# Altium project lab2_kochurin_buck.PrjPcb
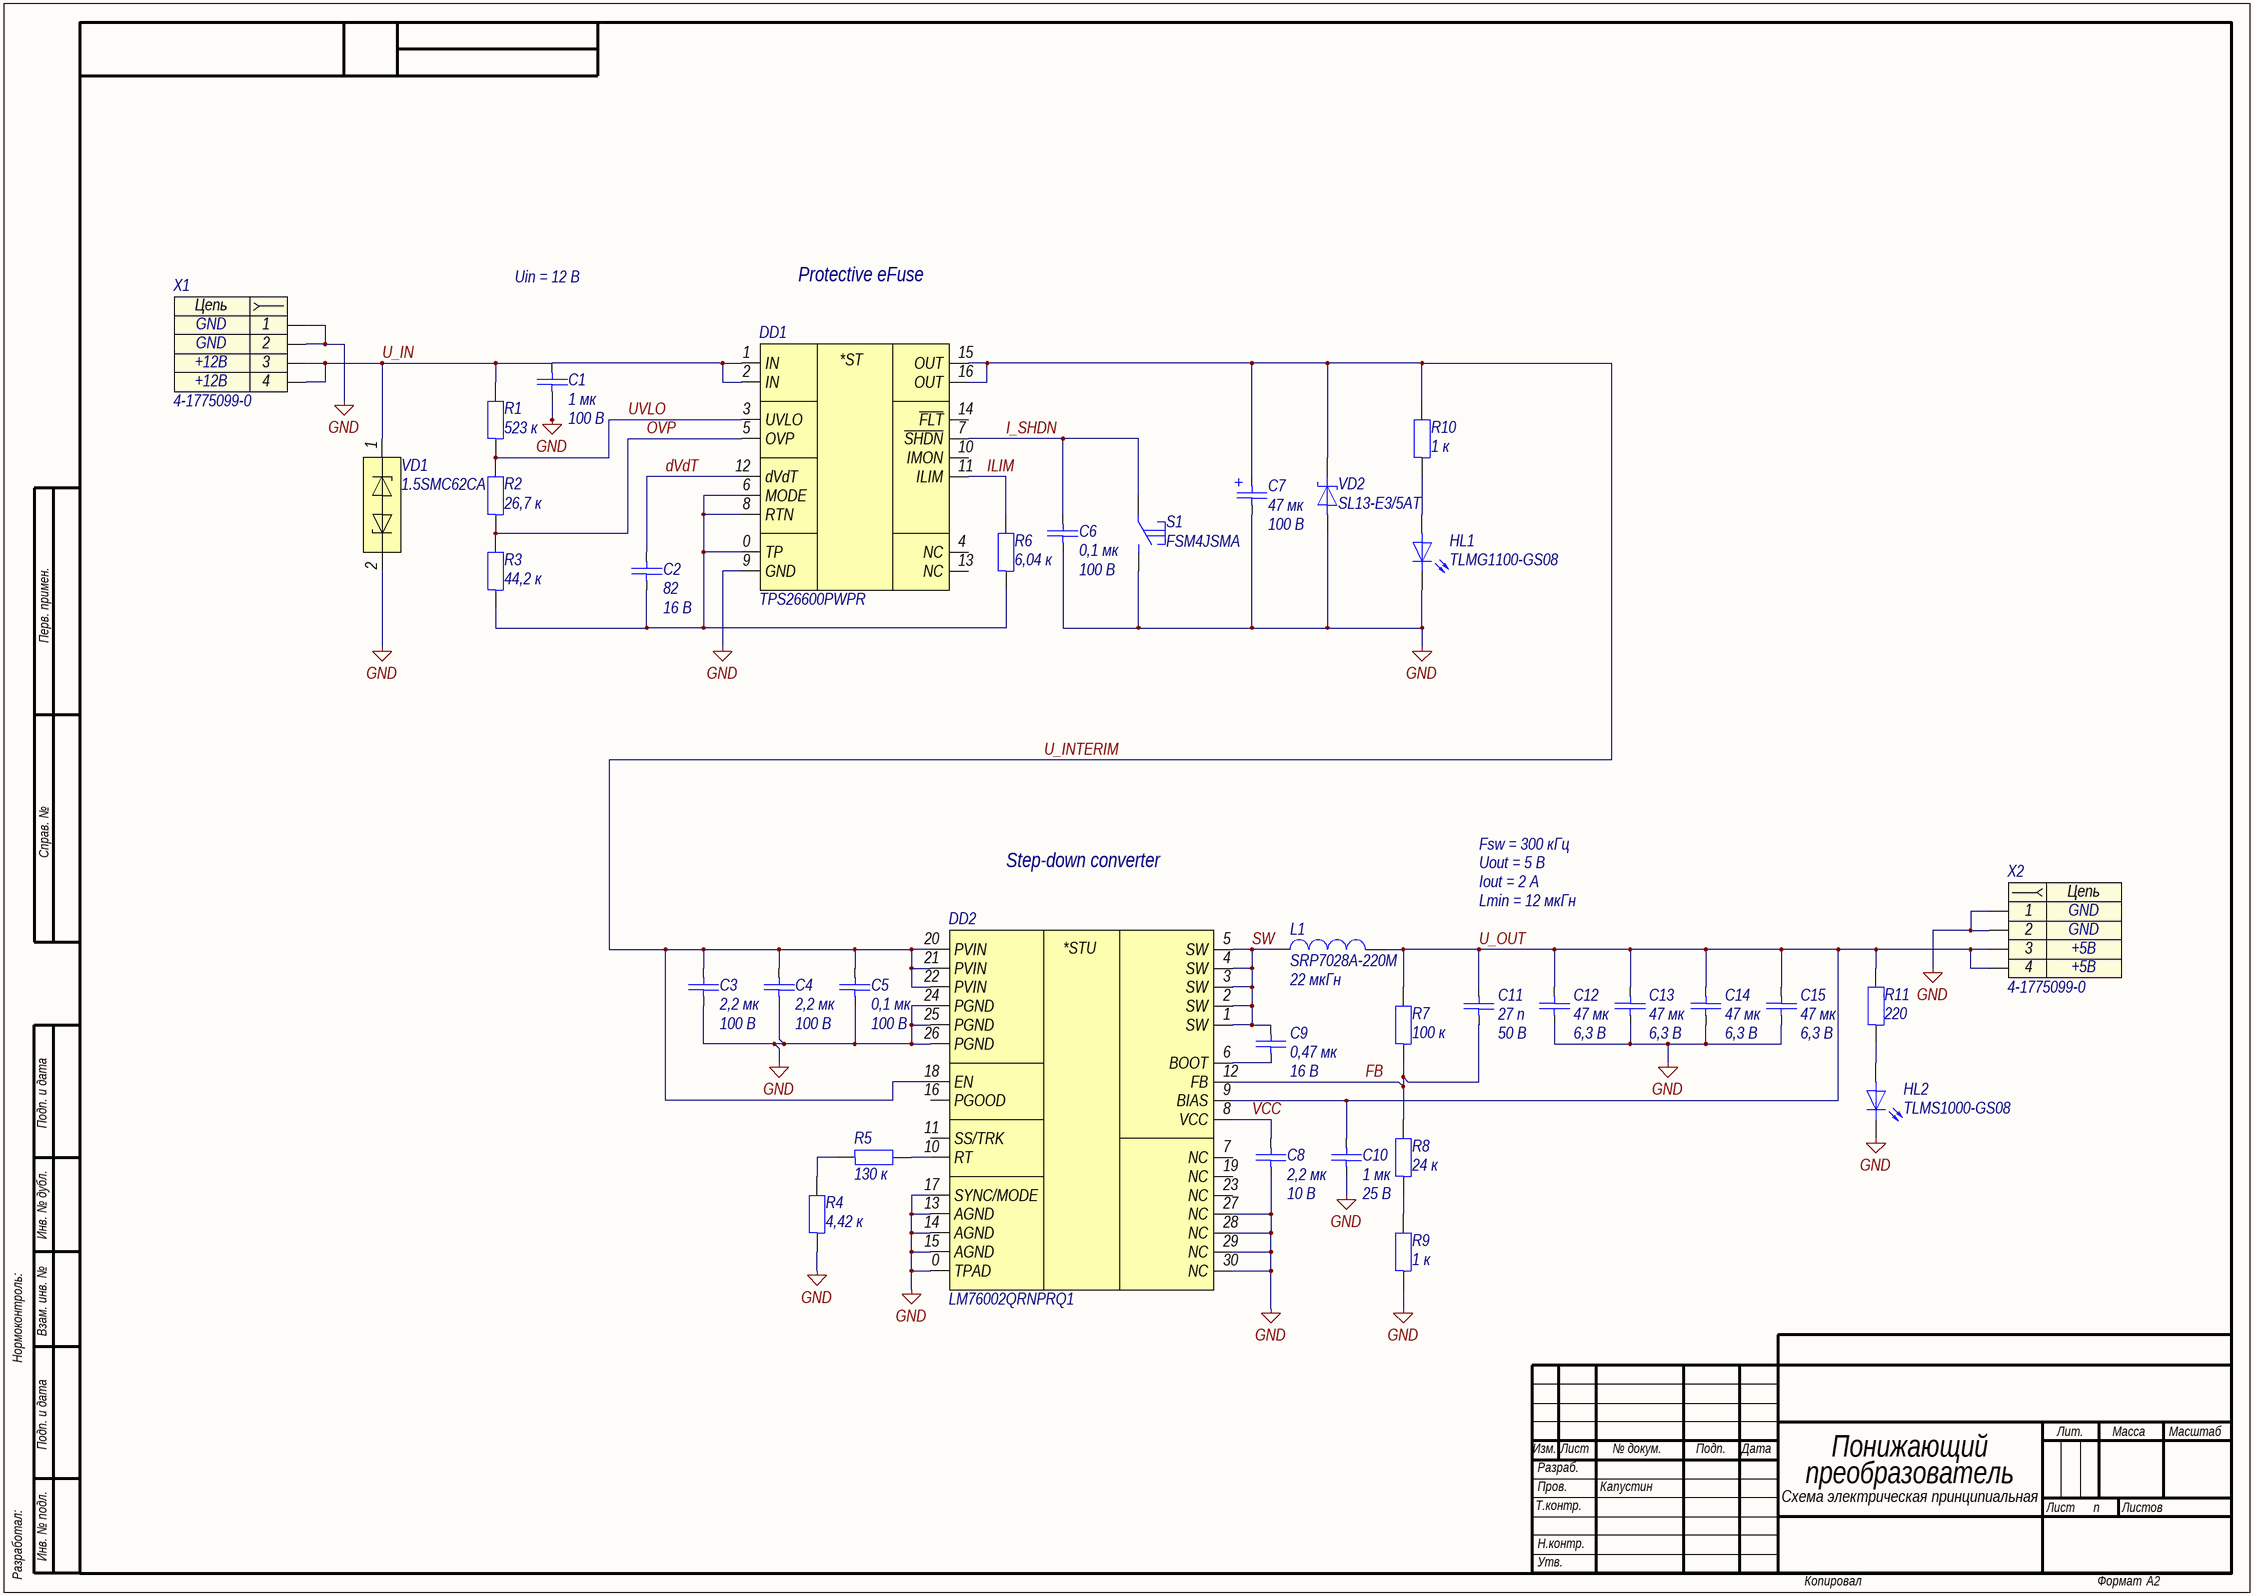
[diagram p0: lab2_kochurin_buck.SchDoc]
approver: Капустин; check: Капустин; designation: СПБПУ.3331506.013; developer: Кочурин; document_code: Ý3; document_type: Схема электрическая принципиальная; pcb_dec_number: СПБПУ.3331506.013; project: Понижающий преобразователь; sheets_total: 1; title: Понижающий преобразователь; title_line_1: Понижающий; title_line_2: преобразователь
1 sheet, 36 parts. Net scope: global (net labels, ports and power ports of the same name join across sheets).
Board file: lab2_kochurin_buck.PcbDoc

## Sheet lab2_kochurin_buck.SchDoc: Понижающий преобразователь
size 594 x 420 mm; ApprovedBy: Капустин; CheckedBy: Капустин; DrawnBy: Кочурин; DocumentNumber: СПБПУ.3331506.013Ý3; SheetNumber: n; SheetTotal: 1; DocumentCode: Ý3; ImagePath: СПБПУ.3331506.013

### Parts
C1  1 мк  Напряжение: 100 В  [C1206]
C2  82  Напряжение: 16 В  [C0603]
C3  2,2 мк  Напряжение: 100 В  [C1206]
C4  2,2 мк  Напряжение: 100 В  [C1206]
C5  0,1 мк  Напряжение: 100 В  [C0603]
C6  0,1 мк  Напряжение: 100 В  [C0603]
C7  47 мк  Напряжение: 100 В  [CAPAE-1000X1000X1200]
C8  2,2 мк  Напряжение: 10 В  [C0603]
C9  0,47 мк  Напряжение: 16 В  [C0603]
C10  1 мк  Напряжение: 25 В  [C0603]
C11  27 п  Напряжение: 50 В  [C0402]
C12  47 мк  Напряжение: 6,3 В  [C0603]
C13  47 мк  Напряжение: 6,3 В  [C0603]
C14  47 мк  Напряжение: 6,3 В  [C0603]
C15  47 мк  Напряжение: 6,3 В  [C0603]
DD1  TPS26600PWPR  [HTSSOP-16]
DD2  LM76002QRNPRQ1  [WQFN-30]
HL1  TLMG1100-GS08  [HL0603]
HL2  TLMS1000-GS08  [HL0603]
L1  SRP7028A-220M  Индуктивность: 22 мкГн  [SRP-2-670X660X280]
R1  523 к  [R0603]
R2  26,7 к  [R0603]
R3  44,2 к  [R0603]
R4  4,42 к  [R0603]
R5  130 к  [R0603]
R6  6,04 к  [R0603]
R7  100 к  [R0603]
R8  24 к  [R0603]
R9  1 к  [R0603]
R10  1 к  [R1218]
R11  220  [R0603]
S1  FSM4JSMA  [FSM4JSMA]
VD1  1.5SMC62CA  [DO-214AB]
VD2  SL13-E3/5AT  [DO-214AC]
X1  4-1775099-0  [4-1775099-0]
X2  4-1775099-0  [4-1775099-0]

### Nets
GND: C1.2 C3.2 C4.2 C5.2 C6.2 C7.2 C8.2 C10.2 C12.1 C13.1 C14.1 C15.1 DD1.9(GND) DD2.0(TPAD) DD2.13(AGND) DD2.14(AGND) DD2.15(AGND) DD2.17(SYNC/MODE) DD2.24(PGND) DD2.25(PGND) DD2.26(PGND) DD2.27(NC) DD2.28(NC) DD2.29(NC) DD2.30(NC) HL1.1 HL2.1 R4.1 R9.1 S1.2 VD1.2 VD2.2 X1.1 X1.2 X2.1 X2.2
dVdT: C2.1 DD1.12(dVdT)
FB: C11.2 DD2.12(FB) R7.1 R8.2
I_SHDN: C6.1 DD1.7(~{SHDN}) S1.1
ILIM: DD1.11(ILIM) R6.2
OVP: DD1.5(OVP) R2.1 R3.2
SW: C9.1 DD2.1(SW) DD2.2(SW) DD2.3(SW) DD2.4(SW) DD2.5(SW) L1.1
U_IN: C1.1 DD1.1(IN) DD1.2(IN) R1.2 VD1.1 X1.3 X1.4
U_INTERIM: C3.1 C4.1 C5.1 C7.1 DD1.15(OUT) DD1.16(OUT) DD2.18(EN) DD2.20(PVIN) DD2.21(PVIN) DD2.22(PVIN) R10.2 VD2.1
U_OUT: C10.1 C11.1 C12.2 C13.2 C14.2 C15.2 DD2.9(BIAS) L1.2 R7.2 R11.2 X2.3 X2.4
UVLO: DD1.3(UVLO) R1.1 R2.2
VCC: C8.1 DD2.8(VCC)
NetC2_2: C2.2 DD1.0(TP) DD1.6(MODE) DD1.8(RTN) R3.1 R6.1
NetC9_2: C9.2 DD2.6(BOOT)
NetDD2_10: DD2.10(RT) R5.2
NetHL1_2: HL1.2 R10.1
NetHL2_2: HL2.2 R11.1
NetR4_2: R4.2 R5.1
NetR8_1: R8.1 R9.2

Not connected (* = marked no-connect by the designer): DD1 4(NC) 10(IMON) 13(NC) 14(~{FLT}); DD2 7(NC) 11(SS/TRK) 16(PGOOD) 19(NC) 23(NC)

### Notes on the sheet
- Uin = 12 В
- Protective eFuse
- Step-down converter
- Fsw = 300 кГц
- Uout = 5 В
- Iout = 2 А
- Lmin = 12 мкГн
- Перв. примен.
- Справ. №
- Подп. и дата
- Инв. № дубл.
- Нормоконтроль:
- Взам. инв. №
- Изм.
- Лист
- № докум.
- Подп.
- Дата
- Лит.
- Масса
- Масштаб
- Т.контр.
- Пров.
- Разраб.
- Листов
- Разработал:
- Инв. № подл.
- Н.контр.
- Утв.
- Копировал
- Формат
- А2
- (in symbol dd0001) *ST
- (in symbol dd0007) *STU
- (in symbol x0004) Цепь

### Library data of the parts
C1 = c0066: =Описание; ID: c0066; Фамилия: Ларионов; Описание: Конденсатор чип 1206 1 мкФ 100 В ±10 %; Наименование: CC1206KKX7R0BB105; Производитель: YAGEO Corp.; Отклонение: ±10 %; Рабочие температуры: от –55 °С до +125 °С; Температурный коэффициент емкости: X7R; Корпус: 1206; Номинал: 1 мк; Номинальное напряжение: 100 В; HelpURL: https://www.yageo.com/upload/media/product/productsearch/datasheet/mlcc/UPY-NP0X7R_MV_100-to-630V_22.pdf
C2 = c0011: =Описание; ID: c0011; Фамилия: Ларионов; Описание: Конденсатор чип 0603 82 пФ 16 В ±5 %; Наименование: CC0603JRNPO7BN820; Производитель: YAGEO Corp.; Отклонение: ±5 %; Рабочие температуры: от –55 °С до +125 °С; Температурный коэффициент емкости: C0G; Корпус: 0603; Номинал: 82; Номинальное напряжение: 16 В; HelpURL: https://www.yageo.com/upload/media/product/productsearch/datasheet/mlcc/UPY-GP_NP0_16V-to-50V_18.pdf
C3 C4 = c0076: =Описание; ID: c0076; Фамилия: Ларионов; Описание: Конденсатор чип 1206 2,2 мкФ 100 В ±10 %; Наименование: CC1206KKX7R0BB225; Производитель: YAGEO Corp.; Отклонение: ±10 %; Рабочие температуры: от –55 °С до +125 °С; Температурный коэффициент емкости: X7R; Корпус: 1206; Номинал: 2,2 мк; Номинальное напряжение: 100 В; HelpURL: https://www.yageo.com/upload/media/product/productsearch/datasheet/mlcc/UPY-NP0X7R_MV_100-to-630V_22.pdf
C5 C6 = c0036: =Описание; ID: c0036; Фамилия: Ларионов; Описание: Конденсатор чип 0603 100 нФ 100 В ±10 %; Наименование: CC0603KRX7R0BB104; Производитель: YAGEO Corp.; Отклонение: ±10 %; Рабочие температуры: от –55 °С до +125 °С; Температурный коэффициент емкости: X7R; Корпус: 0603; Номинал: 0,1 мк; Номинальное напряжение: 100 В; HelpURL: https://www.yageo.com/upload/media/product/productsearch/datasheet/mlcc/UPY-NP0X7R_MV_100-to-630V_22.pdf
C7 = c0118: =Описание; ID: c0118; Фамилия: Ларионов; Описание: Конденсатор электролитический 47 мкФ 100 В ±20 %; Наименование: MAL214699904E3; Производитель: Vishay Intertechnology, Inc.; Отклонение: ±20 %; Рабочие температуры: от –55 °С до +125 °С; Корпус: CAPAE (10 x 10 x 12); Номинал: 47 мк; Номинальное напряжение: 100 В; Температурный коэффициент емкости: -; HelpURL: https://www.vishay.com/capacitors/list/product-28403/
C8 = c0025: =Описание; ID: c0025; Фамилия: Чернов; Описание: Конденсатор чип 0603 2,2 мкФ 10 В ±10 %; Наименование: CC0603KRX7R6BB225; Производитель: YAGEO Corp.; Отклонение: ±10 %; Рабочие температуры: от -55 °С до +125 °С; Корпус: 0603; Номинал: 2,2 мк; Номинальное напряжение: 10 В; HelpURL: https://www.yageo.com/upload/media/product/productsearch/datasheet/mlcc/UPY-GPHC_X7R_6.3V-to-50V_20.pdf
C9 = c0007: =Описание; ID: c0007; Фамилия: Водорезов; Описание: Конденсатор чип 0603 0,47 мкФ 16 В ±10 %; Наименование: CL10B474KO8VPNC; Производитель: Samsung electro-mechanics; Отклонение: ±10 %; Рабочие температуры: от -55 °С до +125 °С; Корпус: 0603; Номинал: 0,47 мк; Номинальное напряжение: 16 В; HelpURL: http://product.samsungsem.com/mlcc/CL10B474KO8VPN.do
C10 = c0022: =Описание; ID: c0022; Фамилия: Ларионов; Описание: Конденсатор чип 0603 1 мкФ 25 В ±10 %; Наименование: CC0603KRX7R8BB105; Производитель: YAGEO Corp.; Отклонение: ±10 %; Рабочие температуры: от -55 °С до +125 °С; Корпус: 0603; Номинал: 1 мк; Номинальное напряжение: 25 В; HelpURL: https://www.yageo.com/upload/media/product/products/datasheet/mlcc/UPY-GPHC_X7R_6.3V-to-50V_20.pdf
C11 = c0001: =Описание; ID: c0001; Фамилия: Соколов; Описание: Конденсатор чип 0402 27 пФ 50 В ±5 %; Наименование: CL05C270JB5NNNC; Производитель: Samsung electro-mechanics; Отклонение: ±5 %; Рабочие температуры: от -55 °С до +125 °С; Корпус: 0402; Номинал: 27 п; Номинальное напряжение: 50 В; HelpURL: http://product.samsungsem.com/mlcc/CL05C270JB5NNN.do
C12-C15 = c0035: =Описание; ID: c0035; Фамилия: Жернаков; Описание: Конденсатор чип 0603 47 мкФ 6,3 В ±20 %; Наименование: CC0603MRX5R5BB476; Производитель: YAGEO Corp.; Отклонение: ±20 %; Рабочие температуры: от -55 °С до +85 °С; Корпус: 0603; Номинал: 47 мк; Номинальное напряжение: 6,3 В; HelpURL: https://www.yageo.com/upload/media/product/productsearch/datasheet/mlcc/UPY-GPHC_X5R_4V-to-50V_26.pdf
DD1 = dd0001: =Описание; ID: dd0001; Фамилия: Ларионов; Описание: Защитная микросхема eFuse 60 В и 2 А; Производитель: Texas Instruments; Напряжение: от 4,2 В до 60 В; Максимальное напряжение: 62 В; Ток: от 0,1 А до 2,23 А; Рабочие температуры: от -40 °С до +125 °С; Наименование: TPS26600PWPR; Корпус: HTSSOP-16; HelpURL: https://www.ti.com/product/TPS2660
DD2 = dd0007: =Описание; ID: dd0007; Фамилия: Кочурин; Описание: Понижающий преобразователь напряжения 60 В и 2,5 А; Производитель: Texas Instruments; Входное напряжение: от 3,5 В до 60 В; Выходное напряжение: от 1 В до 57 В; Коммутируемый ток: от 0 А до 2,5 А; Частота переключения: от 300 кГц до 2,2 МГц; Рабочие температуры: от -40 °С до +125 °С; Наименование: LM76002QRNPRQ1; Корпус: WQFN-30; HelpURL: https://www.ti.com/product/LM76002-Q1
HL1 = hl0005: =Описание; ID: hl0005; Фамилия: Ларионов; Описание: Светодиод чип 0603 зеленый; Производитель: Vishay Intertechnology, Inc.; Цвет: Green; Номинальная сила света: 35 мкд; Номинальная длина волны: 570 нм; Номинальный прямой ток: 30 мА; Номинальное падение напряжения: 2,1 В; Рассеиваемая мощность: 90 мВт; Рабочие температуры: от -40 °С до +100 °С; Корпус: 0603; Наименование: TLMG1100-GS08; HelpURL: https://www.vishay.com/leds/list/product-83173/
HL2 = hl0001: =Описание; ID: hl0001; Фамилия: Ларионов; Описание: Светодиод чип 0603 красный; Производитель: Vishay Intertechnology, Inc.; Цвет: Red; Номинальная сила света: 4 мкд; Номинальная длина волны: 628 нм; Номинальный прямой ток: 15 мА; Номинальное падение напряжения: 1,8 В; Рассеиваемая мощность: 40 мВт; Рабочие температуры: от -40 °С до +100 °С; Корпус: 0603; Наименование: TLMS1000-GS08; HelpURL: https://www.vishay.com/leds/list/product-83172/
L1 = l0006: =Описание; ID: l0006; Фамилия: Ларионов; Описание: Катушка индуктивности 22 мкГн ±20 %; Производитель: Bourns, Inc.; Отклонение: ±20 %; Номинальное активное сопротивление: 165 мОм; Максимальное активное сопротивление: 190 мОм; Резонансная частота: 10 МГц; Номинальный ток (при нагреве на 20 °С/40 °С): 2 А; Ток насыщения: 3,5 А; Рабочее напряжение: не указано; Рабочие температуры: от –55 °С до +150 °С; Корпус: 6,7 x 6,6 x 2,8; Наименование: SRP7028A-220M; Номинал: 22 мкГн; HelpURL: https://www.bourns.com/products/magnetic-products/power-inductors-aec-q200-compliant/product/SRP7028A
R1 = r0119: =Описание; ID: r0119; Фамилия: Жернаков; Описание: Резистор чип 0603 523 кОм ±1 % 0,1 Вт; Наименование: RC0603FR-07523KL; Производитель: YAGEO Corp.; Отклонение: ±1 %; Номинальное напряжение: 75 В; Рабочие температуры: от –55 °С до +155 °С; Номинальный ток: 1 А; Корпус: 0603; Номинал: 523 к; HelpURL: https://www.yageo.com/upload/media/product/productsearch/datasheet/rchip/PYu-RC_Group_51_RoHS_L_11.pdf
R2 = r0022: =Описание; ID: r0022; Фамилия: Ларионов; Описание: Резистор чип 0603 26,7 кОм ±1 % 0,1 Вт; Наименование: RC0603FR-0726K7L; Производитель: YAGEO Corp.; Отклонение: ±1 %; Номинальное напряжение: 75 В; Рабочие температуры: от -55 °С до +155 °С; Номинальный ток: 1 А; Корпус: 0603; Номинал: 26,7 к; HelpURL: https://www.yageo.com/upload/media/product/productsearch/datasheet/rchip/PYu-RC_Group_51_RoHS_L_11.pdf
R3 = r0023: =Описание; ID: r0023; Фамилия: Ларионов; Описание: Резистор чип 0603 44,2 кОм ±1 % 0,1 Вт; Наименование: RC0603FR-0744K2L; Производитель: YAGEO Corp.; Отклонение: ±1 %; Номинальное напряжение: 75 В; Рабочие температуры: от -55 °С до +155 °С; Номинальный ток: 1 А; Корпус: 0603; Номинал: 44,2 к; HelpURL: https://www.yageo.com/upload/media/product/productsearch/datasheet/rchip/PYu-RC_Group_51_RoHS_L_11.pdf
R4 = r0028: =Описание; ID: r0028; Фамилия: Жернаков; Описание: Резистор чип 0603 4,42 кОм ±1 % 0,1 Вт; Наименование: RC0603FR-074K42L; Производитель: YAGEO Corp.; Отклонение: ±1 %; Номинальное напряжение: 75 В; Рабочие температуры: от -55 °С до +155 °С; Номинальный ток: 1 А; Корпус: 0603; Номинал: 4,42 к; HelpURL: https://www.yageo.com/upload/media/product/productsearch/datasheet/rchip/PYu-RC_Group_51_RoHS_L_11.pdf
R5 = r0077: =Описание; ID: r0077; Фамилия: Паньков; Описание: Резистор чип 0603 130 кОм ±1 % 0,1 Вт; Наименование: RC0603FR-07130KL; Производитель: YAGEO Corp.; Отклонение: ±1 %; Номинальное напряжение: 75 В; Рабочие температуры: от -55 °С до +155 °С; Номинальный ток: 1 А; Корпус: 0603; Номинал: 130 к; HelpURL: https://www.yageo.com/upload/media/product/productsearch/datasheet/rchip/PYu-RC_Group_51_RoHS_L_11.pdf
R6 = r0015: =Описание; ID: r0015; Фамилия: Ларионов; Описание: Резистор чип 0603 6,04 кОм ±1 % 0,1 Вт; Наименование: RC0603FR-076K04L; Производитель: YAGEO Corp.; Отклонение: ±1 %; Номинальное напряжение: 75 В; Рабочие температуры: от -55 °С до +155 °С; Номинальный ток: 1 А; Корпус: 0603; Номинал: 6,04 к; HelpURL: https://www.yageo.com/upload/media/product/productsearch/datasheet/rchip/PYu-RC_Group_51_RoHS_L_11.pdf
R7 = r0073: =Описание; ID: r0073; Фамилия: Водорезов; Описание: Резистор чип 0603 100 кОм ±1 % 0,1 Вт; Наименование: RC0603FR-07100KL; Производитель: YAGEO Corp.; Отклонение: ±1 %; Номинальное напряжение: 75 В; Рабочие температуры: от -55 °С до +155 °С; Номинальный ток: 1 А; Корпус: 0603; Номинал: 100 к; HelpURL: https://www.yageo.com/upload/media/product/productsearch/datasheet/rchip/PYu-RC_Group_51_RoHS_L_11.pdf
R8 = r0052: =Описание; ID: r0052; Фамилия: Паньков; Описание: Резистор чип 0603 24 кОм ±1 % 0,1 Вт; Наименование: RC0603FR-0724KL; Производитель: YAGEO Corp.; Отклонение: ±1 %; Номинальное напряжение: 75 В; Рабочие температуры: от -55 °С до +155 °С; Номинальный ток: 1 А; Корпус: 0603; Номинал: 24 к; HelpURL: https://www.yageo.com/upload/media/product/productsearch/datasheet/rchip/PYu-RC_Group_51_RoHS_L_11.pdf
R9 = r0012: =Описание; ID: r0012; Фамилия: Ларионов; Описание: Резистор чип 0603 1 кОм ±1 % 0,1 Вт; Наименование: RC0603FR-071KL; Производитель: YAGEO Corp.; Отклонение: ±1 %; Номинальное напряжение: 75 В; Рабочие температуры: от -55 °С до +155 °С; Номинальный ток: 1 А; Корпус: 0603; Номинал: 1 к; HelpURL: https://www.yageo.com/upload/media/product/productsearch/datasheet/rchip/PYu-RC_Group_51_RoHS_L_11.pdf
R10 = r0032: =Описание; ID: r0032; Фамилия: Ларионов; Описание: Резистор чип 1218 1 кОм ±1 % 1 Вт; Наименование: AA1218FK-071KL; Производитель: YAGEO Corp.; Отклонение: ±1 %; Номинальное напряжение: 200 В; Рабочие температуры: от –55 °С до +155 °С; Номинальный ток: 6 А; Корпус: 1218; Номинал: 1 к; HelpURL: https://www.yageo.com/upload/media/product/productsearch/datasheet/rchip/PYu-AA_51_RoHS_L_3.pdf
R11 = r0009: =Описание; ID: r0009; Фамилия: Ларионов; Описание: Резистор чип 0603 220 Ом ±1 % 0,1 Вт; Наименование: RC0603FR-07220RL; Производитель: YAGEO Corp.; Отклонение: ±1 %; Номинальное напряжение: 75 В; Рабочие температуры: от -55 °С до +155 °С; Номинальный ток: 1 А; Корпус: 0603; Номинал: 220; HelpURL: https://www.yageo.com/upload/media/product/productsearch/datasheet/rchip/PYu-RC_Group_51_RoHS_L_11.pdf
S1 = sw0001: =Описание; ID: sw0001; Фамилия: Паньков; Описание: Тактовая кнопка поверхностного монтажа; Производитель: TE Connectivity; Ток нагрузки: 50 мА @ 24 В; Сопротивление контакта: 100 мОм; Количество контактов: 4; Рабочие температуры: от –35 °С до +85 °С; Промывка: Разрешена; Корпус: 6,00x6,00x4,98; Наименование: FSM4JSMA; HelpURL: https://www.te.com/usa-en/product-4-1437565-1.html
VD1 = vd0004: =Описание; ID: vd0004; Фамилия: Ларионов; Описание: Двунаправленная диодная сборка для подавления помех, 53 В; Производитель: Littelfuse, Inc.; Наименование: 1.5SMC62CA; Корпус: DO-214AB; HelpURL: https://www.littelfuse.com/products/tvs-diodes/surface-mount/1_5smc.aspx
VD2 = vd0002: =Описание; ID: vd0002; Фамилия: Ларионов; Описание: Диод Шоттки 30 В 1,5 А; Производитель: Vishay Intertechnology, Inc.; Пиковое прямое напряжение: 0,445 В; Импульсное обратное напряжение: 30 В; Макс допустимый средний прямой ток: 1,5 А; Рабочие температуры: от –55 °С до +125 °С; Наименование: SL13-E3/5AT; Корпус: DO-214AC; HelpURL: https://www.vishay.com/product?docid=88740
X1 = x0004: =Описание; Contact_1: GND; Contact_3: +12В; ID: x0004; Фамилия: Ларионов; Описание: ATX Power 4 pin гнездо прямой; Производитель: TE Connectivity; Contact_2: GND; Contact_4: +12В; Наименование: 4-1775099-0; HelpURL: https://www.te.com/usa-en/product-4-1775099-0.html
X2 = x0004: =Описание; Contact_1: GND; Contact_3: +5В; ID: x0004; Фамилия: Ларионов; Описание: ATX Power 4 pin гнездо прямой; Производитель: TE Connectivity; Contact_2: GND; Contact_4: +5В; Наименование: 4-1775099-0; HelpURL: https://www.te.com/usa-en/product-4-1775099-0.html